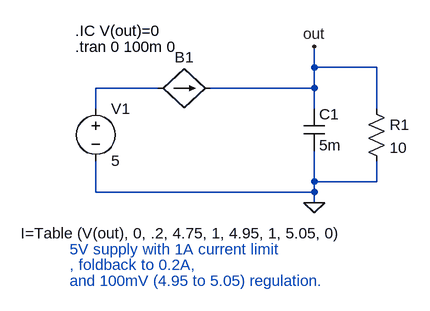
[diagram p0: schematic b3.asc]
b3.asc, the LTspice schematic file:
Version 4
SHEET 1 880 680
WIRE 160 176 160 144
WIRE 160 240 160 288
WIRE -176 176 -176 144
WIRE -176 144 -80 144
WIRE 0 144 160 144
WIRE 160 144 160 112
WIRE -176 256 -176 304
WIRE -176 304 160 304
WIRE 160 304 160 320
WIRE 160 112 256 112
WIRE 160 112 160 80
WIRE 256 112 256 176
WIRE 160 288 256 288
WIRE 160 288 160 304
WIRE 256 288 256 256
FLAG 160 320 0
FLAG 160 80 out
SYMBOL voltage -176 160 R0
WINDOW 123 0 0 Left 0
WINDOW 39 -56 56 VBottom 0
SYMATTR InstName V1
SYMATTR Value 5
SYMBOL cap 144 176 R0
SYMATTR InstName C1
SYMATTR Value 5m
SYMBOL bi -80 144 R270
WINDOW 0 32 40 VTop 0
WINDOW 3 -208 36 VBottom 0
SYMATTR InstName B1
SYMATTR Value I=Table (V(out), 0, .2, 4.75, 1, 4.95, 1, 5.05, 0)
SYMBOL res 240 160 R0
SYMATTR InstName R1
SYMATTR Value 10
TEXT -208 80 Left 0 !.tran 0 100m 0
TEXT -208 56 Left 0 !.IC V(out)=0
TEXT -216 392 Left 0 ;5V supply with 1A current limit
TEXT -216 416 Left 0 ;, foldback to 0.2A,
TEXT -216 440 Left 0 ;and 100mV (4.95 to 5.05) regulation.

The netlist it stands for:
* b3.asc
V1 N001 0 5
C1 out 0 5m
B1 N001 out I=Table (V(out), 0, .2, 4.75, 1, 4.95, 1, 5.05, 0)
R1 out 0 10
.tran 0 100m 0
.IC V(out)=0
* 5V supply with 1A current limit
* , foldback to 0.2A,
* and 100mV (4.95 to 5.05) regulation.
.backanno
.end